# Altium project Nhúng - Nhóm 2.PrjPcb
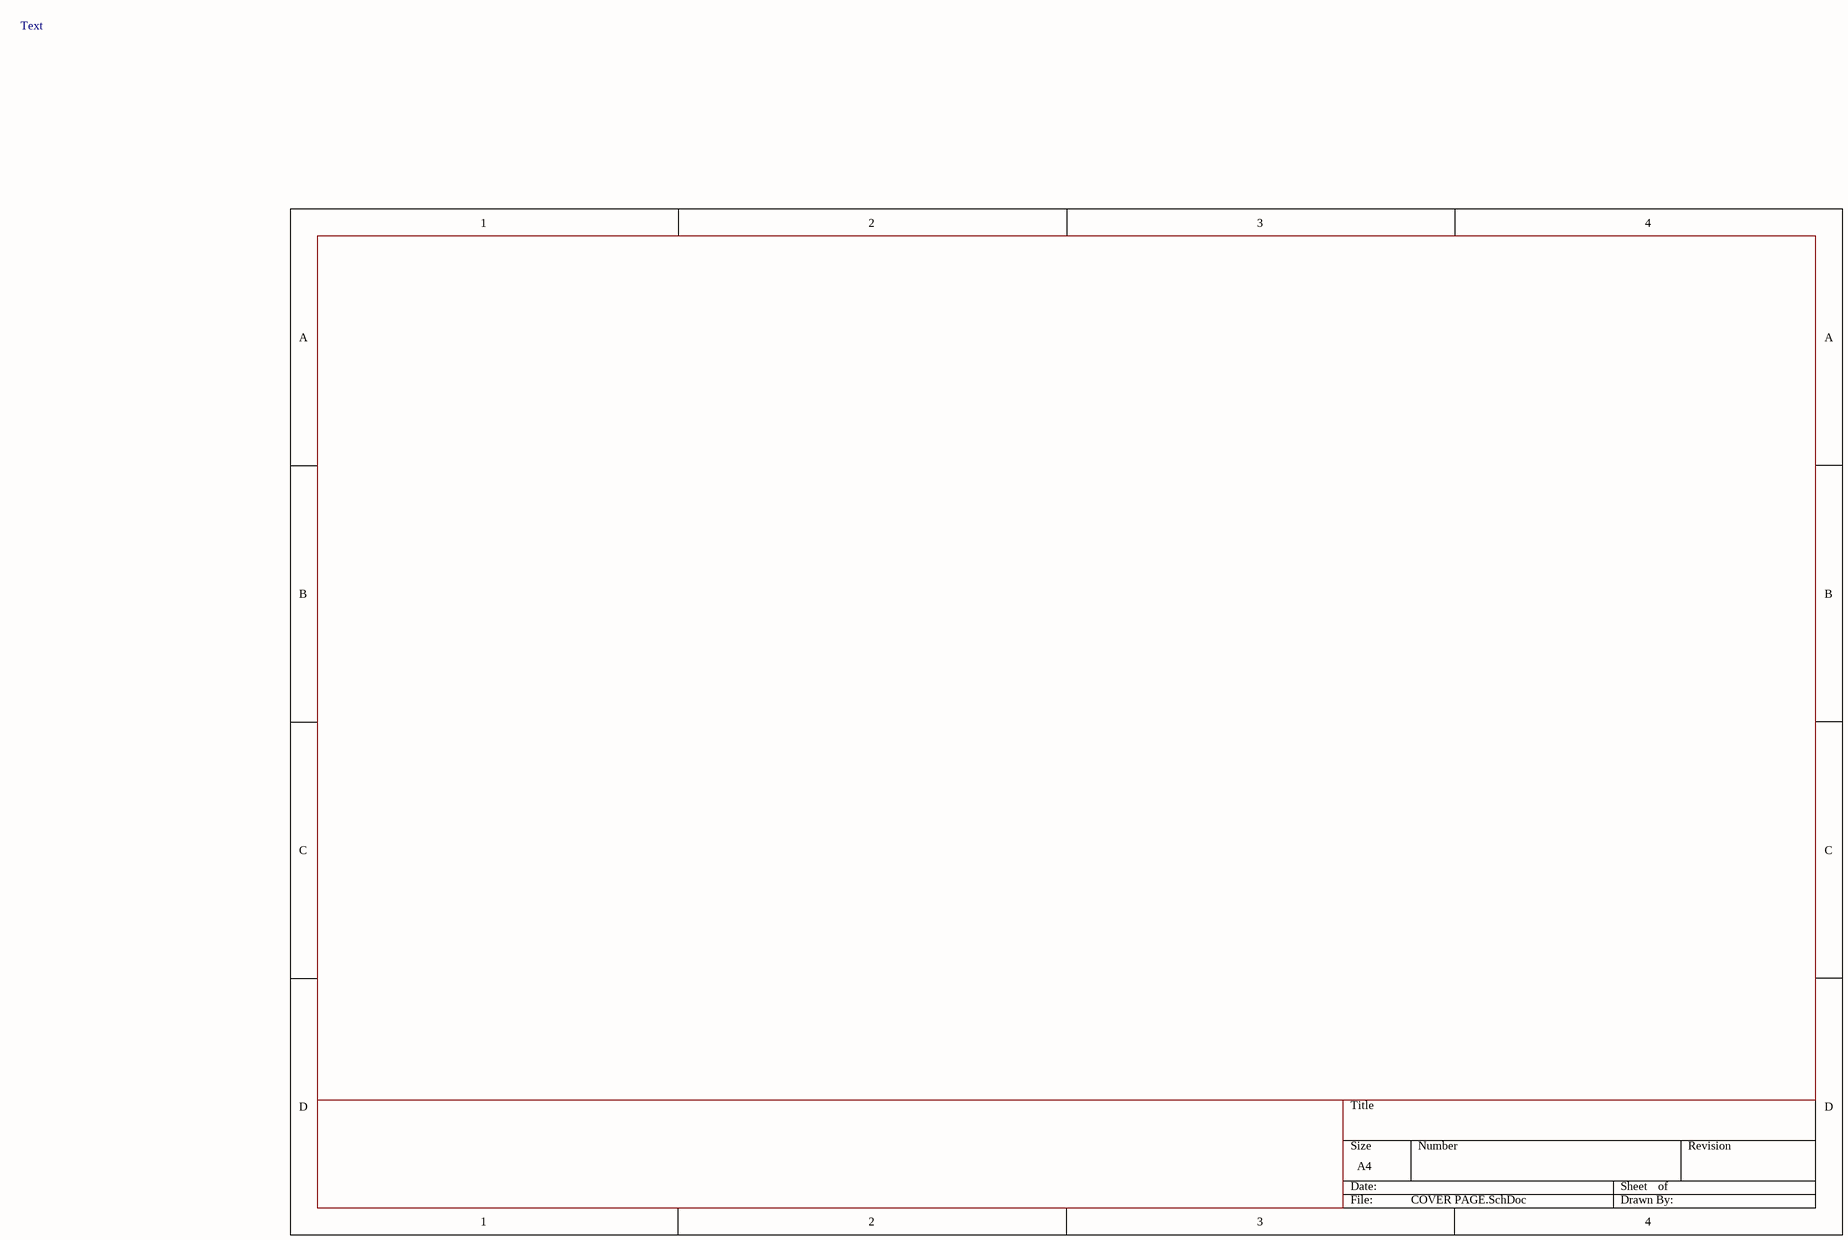
[diagram p0: COVER PAGE.SchDoc]
5 sheets, 82 parts. Net scope: flat (ports and power ports of the same name join across sheets).
Board file: LAYOUT MODULE WIFI LAMP CONTROL.PcbDoc
Sheets:
  COVER PAGE.SchDoc
  BLOCK DIAGRAM.SchDoc
  NODE MCU ESP12.SchDoc
  MODULE WIFI LAMP CONTROL.SchDoc
  MODULE PINOUT WIFI LAMP CONTROL.SchDoc

## Sheet COVER PAGE.SchDoc
size A4

### Notes on the sheet
- Text

## Sheet BLOCK DIAGRAM.SchDoc
size A4
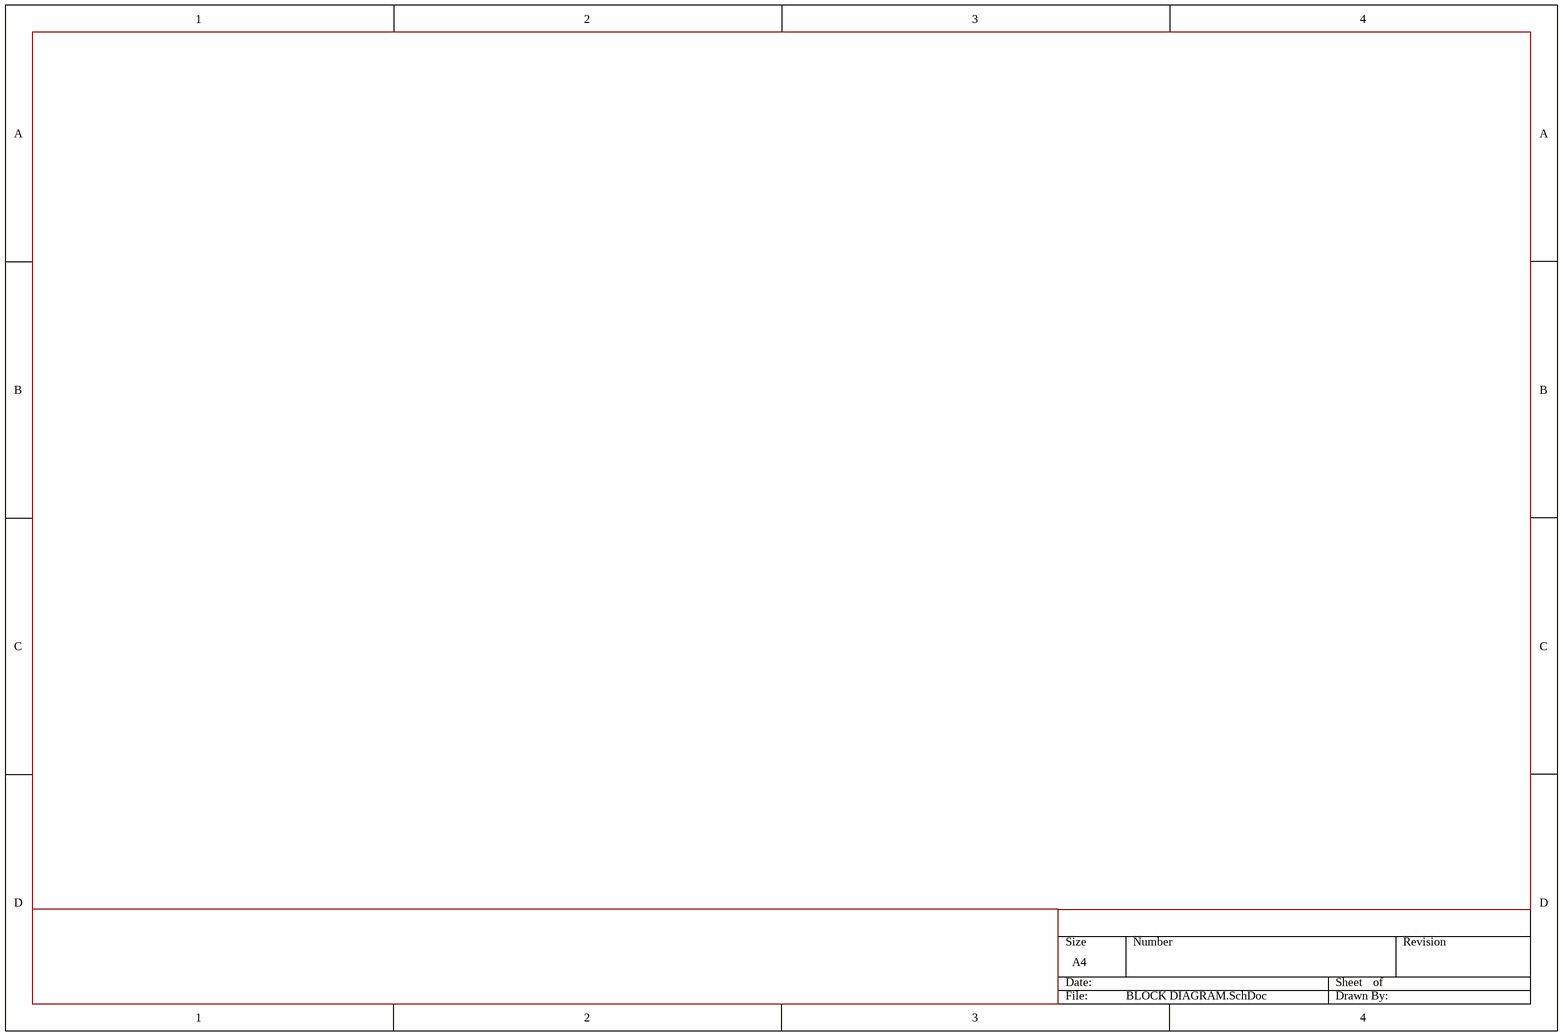
[diagram p1: BLOCK DIAGRAM.SchDoc]

## Sheet NODE MCU ESP12.SchDoc
size A4
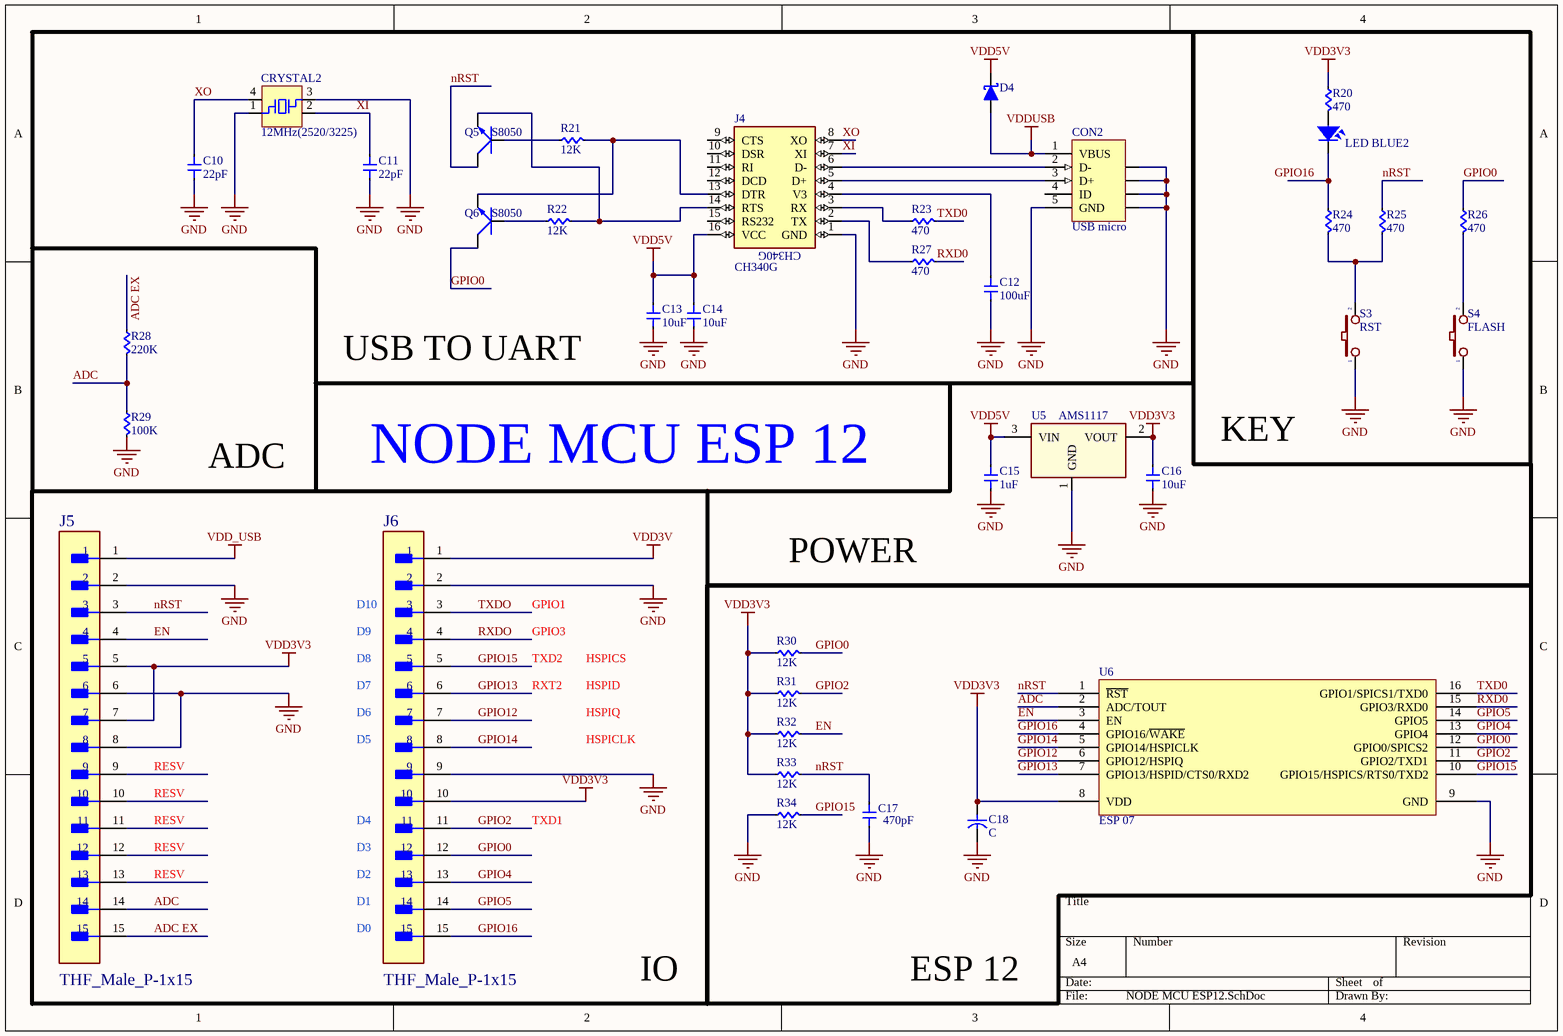
[diagram p2: NODE MCU ESP12.SchDoc]

### Parts
C10  22pF  [Cap 0201]
C11  22pF  [Cap 0201]
C12  100uF  [Cap 0201]
C13  10uF  [Cap 0201]
C14  10uF  [Cap 0201]
C15  1uF  [Cap 0201]
C16  10uF  [Cap 0201]
C17  470pF  [Cap 1210]
C18  C  [C SMD TAN 1210 (B)]
CON2  USB micro  [CONN/USB/MICRO/RA]
CRYSTAL2  12MHz(2520/3225)  [Crystal SMD 4PIN 32x25]
D4  (no value)  [DO-214AC (SMA)]
J4  CH340G  [SOIC-16]
J5  THF_Male_P-1x15  [FP-90121-0135-MFG]
J6  THF_Male_P-1x15  [FP-90121-0135-MFG]
LED_BLUE2  LED  [LED-5-BLUE]  (value not drawn)
Q5  S8050  [TO92]
Q6  S8050  [TO92]
R20  470  [RES 0402]
R21  12K  [RES 0402]
R22  12K  [RES 0402]
R23  470  [RES 0402]
R24  470  [RES 0402]
R25  470  [RES 0402]
R26  470  [RES 0402]
R27  470  [RES 0402]
R28  220K  [RES 0402]
R29  100K  [RES 0402]
R30  12K  [RES 0402]
R31  12K  [RES 0402]
R32  12K  [RES 0402]
R33  12K  [RES 0402]
R34  12K  [RES 0402]
S3  RST  [SW1-SMD]
S4  FLASH  [SW1-SMD]
U5  AMS1117  [SOT-223]
U6  ESP 07  [ESP8266 07]

### Blocks framed on the sheet
KEY: LED_BLUE2 R20 R24-R26 S3 S4
NODE MCU ESP 12: J5 J6

### Nets
GND: C10.1 C11.1 C12.1 C13.1 C14.1 C15.1 C16.1 C17.1 C18.2 CON2.5(GND) CON2.6(SHLD) CON2.7(SHLD) CON2.8(SHLD) CON2.9(SHLD) CRYSTAL2.1(XTAL) CRYSTAL2.3(XTAL) J4.1(GND) J5.2 J5.6 J5.8 J6.2 J6.9 R29.2 R34.1 S3.1 S4.1 U5.1(GND) U6.9(GND)
VDD3V: J6.1
VDD3V3: C16.2 C18.1 J5.5 J5.7 J6.10 R20.1 R30.1 R31.1 R32.1 R33.1 U5.2(VOUT) U6.8(VDD)
VDD5V: C13.2 C14.2 C15.2 D4.2(K) J4.16(VCC) U5.3(VIN)
VDD_USB: J5.1
VDDUSB: CON2.1(VBUS) D4.1(A)
ADC: J5.14 R28.2 R29.1 U6.2(ADC/TOUT)
ADC EX: J5.15 R28.1
EN: J5.4 R32.2 U6.3(EN)
GPIO0: J6.12 Q6.3(C) R26.1 R30.2 U6.12(GPIO0/SPICS2)
GPIO1: J6.3  [also labelled TXDO]
GPIO2: J6.11 R31.2 U6.11(GPIO2/TXD1)  [also labelled TXD1]
GPIO3: J6.4  [also labelled RXDO]
GPIO4: J6.13 U6.13(GPIO4)
GPIO5: J6.14 U6.14(GPIO5)
GPIO12: J6.7 U6.6(GPIO12/HSPIQ)
GPIO13: J6.6 U6.7(GPIO13/HSPID/CTS0/RXD2)  [also labelled RXT2]
GPIO14: J6.8 U6.5(GPIO14/HSPICLK)
GPIO15: J6.5 R34.2 U6.10(GPIO15/HSPICS/RTS0/TXD2)  [also labelled TXD2]
GPIO16: J6.15 U6.4(GPIO16/~{WAKE})
nRST: C17.2 J5.3 Q5.3(C) R25.1 R33.2 U6.1(~{RST})
RESV: J5.9 J5.10 J5.11 J5.12 J5.13
RXD0: R27.2 U6.15(GPIO3/RXD0)
TXD0: R23.2 U6.16(GPIO1/SPICS1/TXD0)
XI: C11.2 CRYSTAL2.2(GND) J4.7(XI)
XO: C10.2 CRYSTAL2.4(GND) J4.8(XO)
NetC12_2: C12.2 J4.4(V3)
NetCON2_2: CON2.2(D-) J4.6(D-)
NetCON2_3: CON2.3(D+) J4.5(D+)
NetJ4_2: J4.2(TX) R27.1
NetJ4_3: J4.3(RX) R23.1
NetJ4_13: J4.13(DTR) Q6.1(E) R21.2
NetJ4_14: J4.14(RTS) Q5.1(E) R22.2
NetLED_BLUE2_1: LED_BLUE2.1 R20.2
NetLED_BLUE2_2: LED_BLUE2.2 R24.1
NetQ5_2: Q5.2(B) R21.1
NetQ6_2: Q6.2(B) R22.1
NetR24_2: R24.2 R25.2 S3.2
NetR26_2: R26.2 S4.2

Not connected (* = marked no-connect by the designer): CON2 4(ID); J4 9(CTS) 10(DSR) 11(RI) 12(DCD) 15(RS232)

### Notes on the sheet
- USB TO UART
- ADC
- POWER
- IO
- ESP 12
- Labels drawn without touching a wire or pin: D0, D1, D2, D3, D4, D5, D6, D7, D8, D9, D10, GPIO16, HSPICLK, HSPICS, HSPID, HSPIQ

### Library data of the parts
C10-C16 = Cap 0201: Capacitor SMD 0201
C17 = Cap 1210: Capacitor SMD 1210
C18 = Capacitor: Capacitor pol
CON2 = CON USB micro: USB micro, 5 pins
CRYSTAL2 = Crystal 4pin
D4 = Diode Schottky: Schottky Diode
J4 = CH340G: USB Interface Integrated Circuit; MF: WCH; MP: Ch340G; Price: None; SnapEDA_Link: https://www.snapeda.com/parts/Ch340G/WCH/view-part/6287223/?ref=snap; Package: Package; Check_prices: https://www.snapeda.com/parts/Ch340G/WCH/view-part/6287223/?ref=eda; Value: *; Availability: No availability data
J5 J6 = CMP-04776-000526-1: CONN HEADER R/A 15POS 2.54MM; Number of Contacts: 15; Voltage Rating: 350V; Glow Wire Compliant: Non-compliant; Current Rating: 3A; Gender: Male; Number of Circuits: 15; Max Operating Temperature: 125°C; Packaging: Tray; Contact Plating: Tin; Package Quantity: 1800; Housing Material: Polyester; Number of Positions: 15; Number of Rows: 1; Pitch: 2.54mm; Series: 90121; Mount: Through Hole; Radiation Hardening: No; Contact Material: Brass; Min Operating Temperature: -55°C; Termination: Through Hole; RoHS Compliant: Yes; Orientation: Right Angle
LED_BLUE2 = LED: LED Single colour Green and Red; Value: LED 3 ly Single Colour
Q5 Q6 = Trans 2N3904: NPN transistor EBC; Value: C9014
R20-R34 = RES 0402: RES SMD 0402; Manufacturer: Vishay Dale; Manufacturer Part Number: CRCW040210K0FKED; Resistance (Ohms): 10k; Tolerance: ±1%; Power (Watts): 0.063W, 1/16W; Temperature Coefficient: ±100ppm/°C; Supplier 1: Digi-Key; RoHS: RoHS Compliant; Category: Resistors; Stock 1: 2392462; Pricing 1: 10=0.083, 50=0.0444, 200=0.0255, 1000=0.0174 (USD); Packaging: Cut Tape (CT); Composition: Thick Film; Features: Automotive AEC-Q200; Operating Temperature: -55°C ~ 155°C; Package / Case: 0402 (1005 Metric); Supplier Device Package: 0402 (1005 Metric); Size / Dimension: 0.039" L x 0.020" W (1.00mm x 0.50mm); Height: 0.016" (0.40mm); Number of Terminations: 2; ComponentLink1URL: http://www.vishay.com/docs/20035/dcrcwe3.pdf; ComponentLink1Description: http://www.vishay.com/docs/20035/dcrcwe3.pdf; Supplier Part Number 1: 541-10.0KLCT-ND
S3 S4 = SW2: Switch button 2 pin; Value: SW chip 2 pin
U5 = AMS1117: 1A LDO Voltage Regulator, ADJ or fixed 1.5/1.8/2.5/2.85/3.3/5V
U6 = ESP8266 07: ESP8266 07 16 Pin; IC: ESP8266-EX; Vendor: Ai-thinker

## Sheet MODULE WIFI LAMP CONTROL.SchDoc
size A4
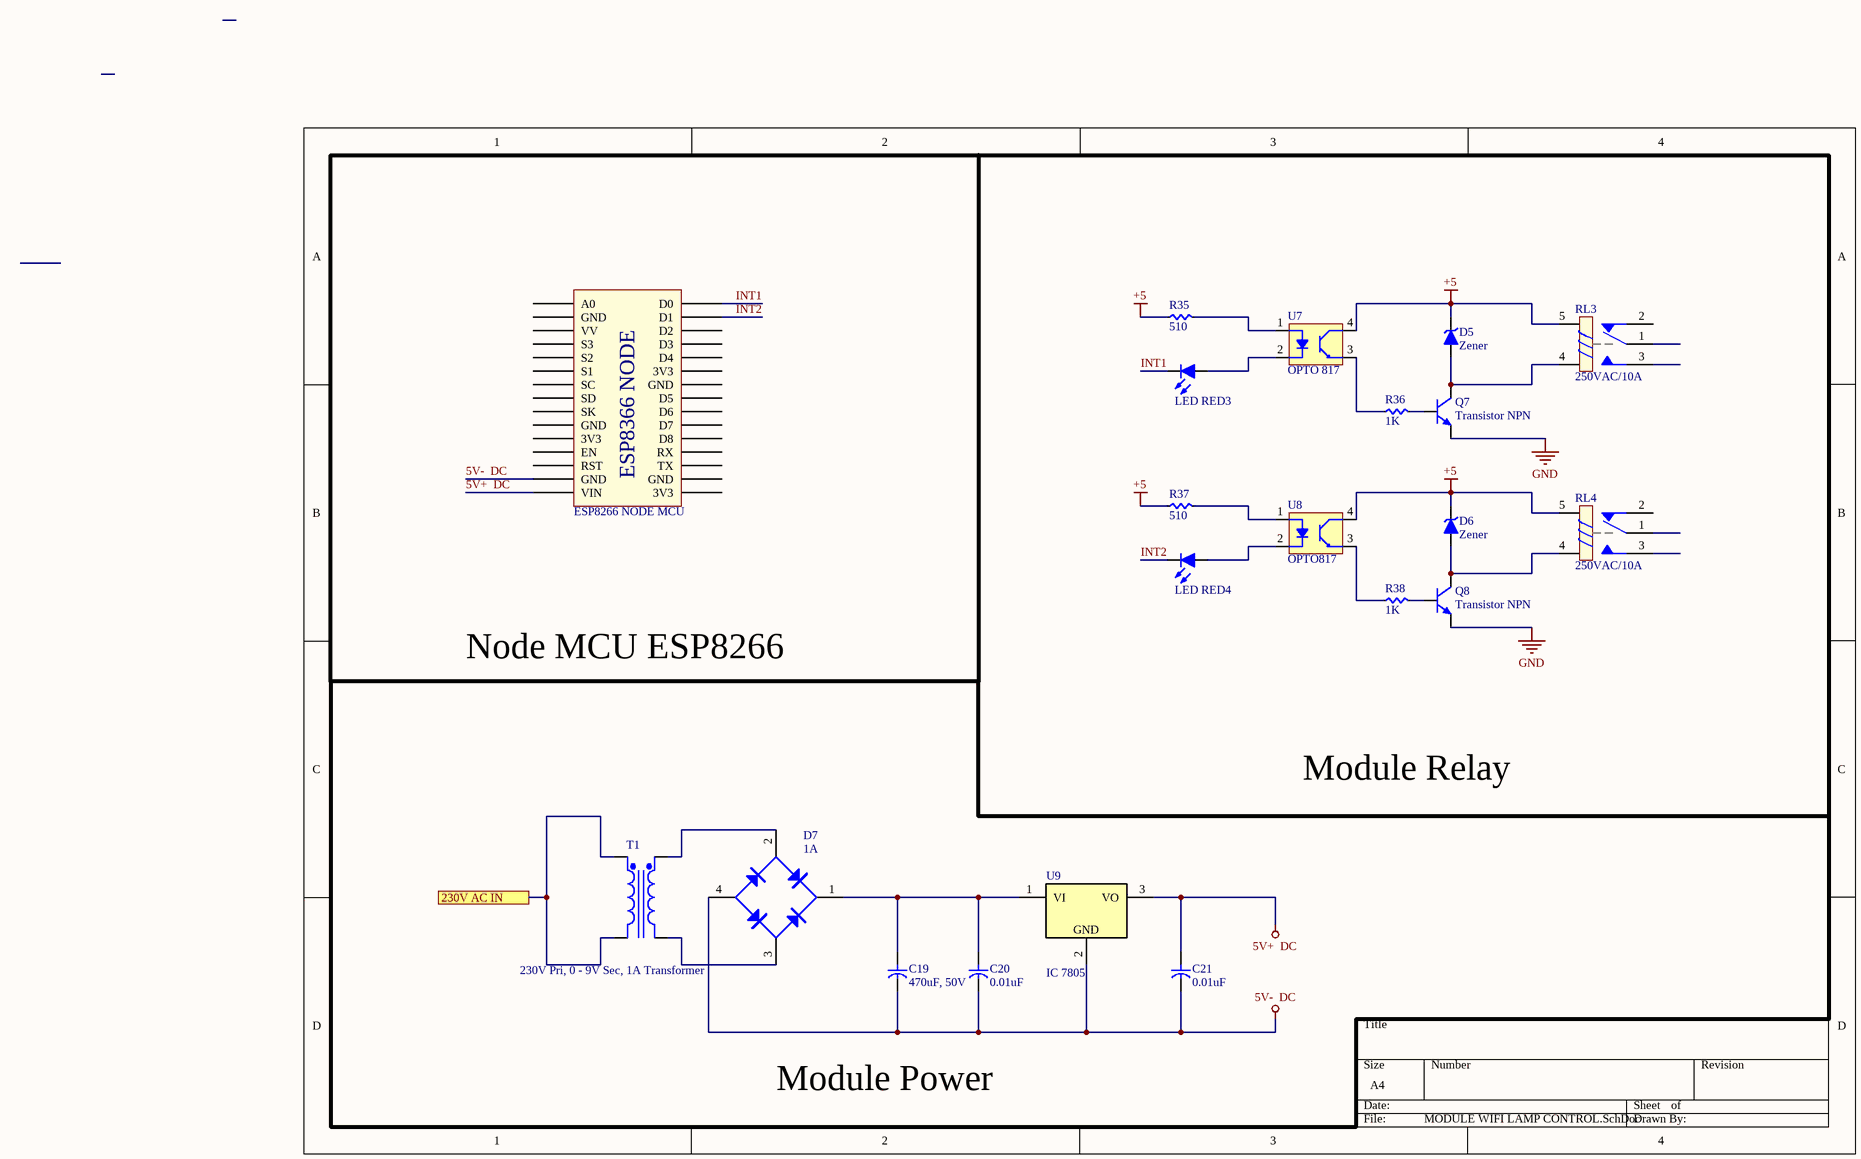
[diagram p3: MODULE WIFI LAMP CONTROL.SchDoc]

### Parts
?  ESP8266 NODE MCU  [ESP8266 NODE MCU]
C19  470uF, 50V  [CYL/D.500/LS.200]
C20  0.01uF  [CYL/D.500/LS.200]
C21  0.01uF  [CYL/D.500/LS.200]
D5  Zener  [DO-41]
D6  Zener  [DO-41]
D7  1A  [BRIDGE_DAN]
LED_RED3  LED RED  [LED 5MM - RED]  (value not drawn)
LED_RED4  LED RED  [LED 5MM - RED]  (value not drawn)
Q7  Transistor NPN  [SOT-23]
Q8  Transistor NPN  [SOT-23]
R35  510  [RES 0402]
R36  1K  [RES 0402]
R37  510  [RES 0402]
R38  1K  [RES 0402]
RL3  250VAC/10A  [Relay 5 Chan SRD]
RL4  250VAC/10A  [Relay 5 Chan SRD]
T1  230V Pri, 0 - 9V Sec, 1A Transformer  [TRF_4]
U7  OPTO 817  [DIP4 - PC817]
U8  OPTO817  [DIP4 - PC817]
U9  IC 7805  [DPAK_118_446_112X59_SMD]

### Ports
230V AC IN

### Nets
5V+  DC: ?.15(VIN) C21.1 U9.3(VO)
5V-  DC: ?.14(GND) C19.2 C20.2 C21.2 D7.4(V-) U9.2
+5: D5.2(K) D6.2(K) R35.1 R37.1 RL3.5 RL4.5 U7.4(C) U8.4(C)
GND: Q7.2(E) Q8.2(E)
INT1: ?.30(D0) LED_RED3.2(K)
INT2: ?.29(D1) LED_RED4.2(K)
NetC19_1: C19.1 C20.1 D7.1(V+) U9.1(VI)
NetD5_1: D5.1(A) Q7.3(C) RL3.4
NetD6_1: D6.1(A) Q8.3(C) RL4.4
NetD7_2: D7.2(AC) T1.3(Sec+)
NetD7_3: D7.3(AC) T1.4(Sec-)
NetLED_RED3_1: LED_RED3.1(A) U7.2(K)
NetLED_RED4_1: LED_RED4.1(A) U8.2(K)
NetQ7_1: Q7.1(B) R36.2
NetQ8_1: Q8.1(B) R38.2
NetR35_2: R35.2 U7.1(A)
NetR36_1: R36.1 U7.3(E)
NetR37_2: R37.2 U8.1(A)
NetR38_1: R38.1 U8.3(E)
NetT1_1: T1.1(Pri+) T1.2(Pri-) ; port 230V AC IN

Not connected (* = marked no-connect by the designer): ? 1(A0) 2(GND) 3(VV) 4(S3) 5(S2) 6(S1) 7(SC) 8(SD) 9(SK) 10(GND) 11(3V3) 12(EN) 13(RST) 16(3V3) 17(GND) 18(TX) 19(RX) 20(D8) 21(D7) 22(D6) 23(D5) 24(GND) 25(3V3) 26(D4) 27(D3) 28(D2); RL3 1 2 3; RL4 1 2 3

### Notes on the sheet
- Node MCU ESP8266
- Module Relay
- Module Power
- (in symbol ESP8266 NODE MCU) ESP8366 NODE
- (in symbol REG_35V_5V-1.5A-7.5W-DPAK) GND

### Library data of the parts
C19-C21 = Capacitor: Capacitor pol
D5 D6 = Diode Zener: Zener Diode
D7 = BRIDGE1: Diode Bridge
LED_RED3 LED_RED4 = Led: Typical LED
Q7 Q8 = Transistor NPN: NPN Bipolar Transistor
R35-R38 = RES 0402: as R20 on sheet NODE MCU ESP12; Supplier 1: Digi-Key; RoHS: RoHS Compliant; Category: Resistors; Stock 1: 2392462; Pricing 1: 10=0.083, 50=0.0444, 200=0.0255, 1000=0.0174 (USD); Packaging: Cut Tape (CT); Composition: Thick Film; Features: Automotive AEC-Q200; Operating Temperature: -55°C ~ 155°C; Package / Case: 0402 (1005 Metric); Supplier Device Package: 0402 (1005 Metric); Size / Dimension: 0.039" L x 0.020" W (1.00mm x 0.50mm); Height: 0.016" (0.40mm); Number of Terminations: 2; ComponentLink1URL: http://www.vishay.com/docs/20035/dcrcwe3.pdf; ComponentLink1Description: http://www.vishay.com/docs/20035/dcrcwe3.pdf; Supplier Part Number 1: 541-10.0KLCT-ND
RL3 RL4 = Relay 5 Chan SRD: Relay 5 Chan; Ma_Hang: MH009374; Ten: Relay 5V10A SRD-05VDC-SL-C Chính Hãng
T1 = Trans Cupl: Transformer (Coupled Inductor Model); Published: 8-Jun-2000; LatestRevisionDate: 17-Jul-2002; LatestRevisionNote: Re-released for DXP Platform.; PackageReference: TRF_4; Publisher: Altium Limited; PackageDescription: Transformer; 4 Leads
U7 U8 = PC817: Opto PC817B
U9 = REG_35V_5V-1.5A-7.5W-DPAK: Linear Voltage Regulator IC 1 Output 1.5A DPAK; Manufacturer: Diodes; Manufacturer Part Number: L7805CDT-TR; Alternate Part Number-1: CJ7805 3%; Case/Package: DPAK; Supplier-1: SP ROAD; Supplier Part Number-1: L7805CDT-TR

## Sheet MODULE PINOUT WIFI LAMP CONTROL.SchDoc
size A4
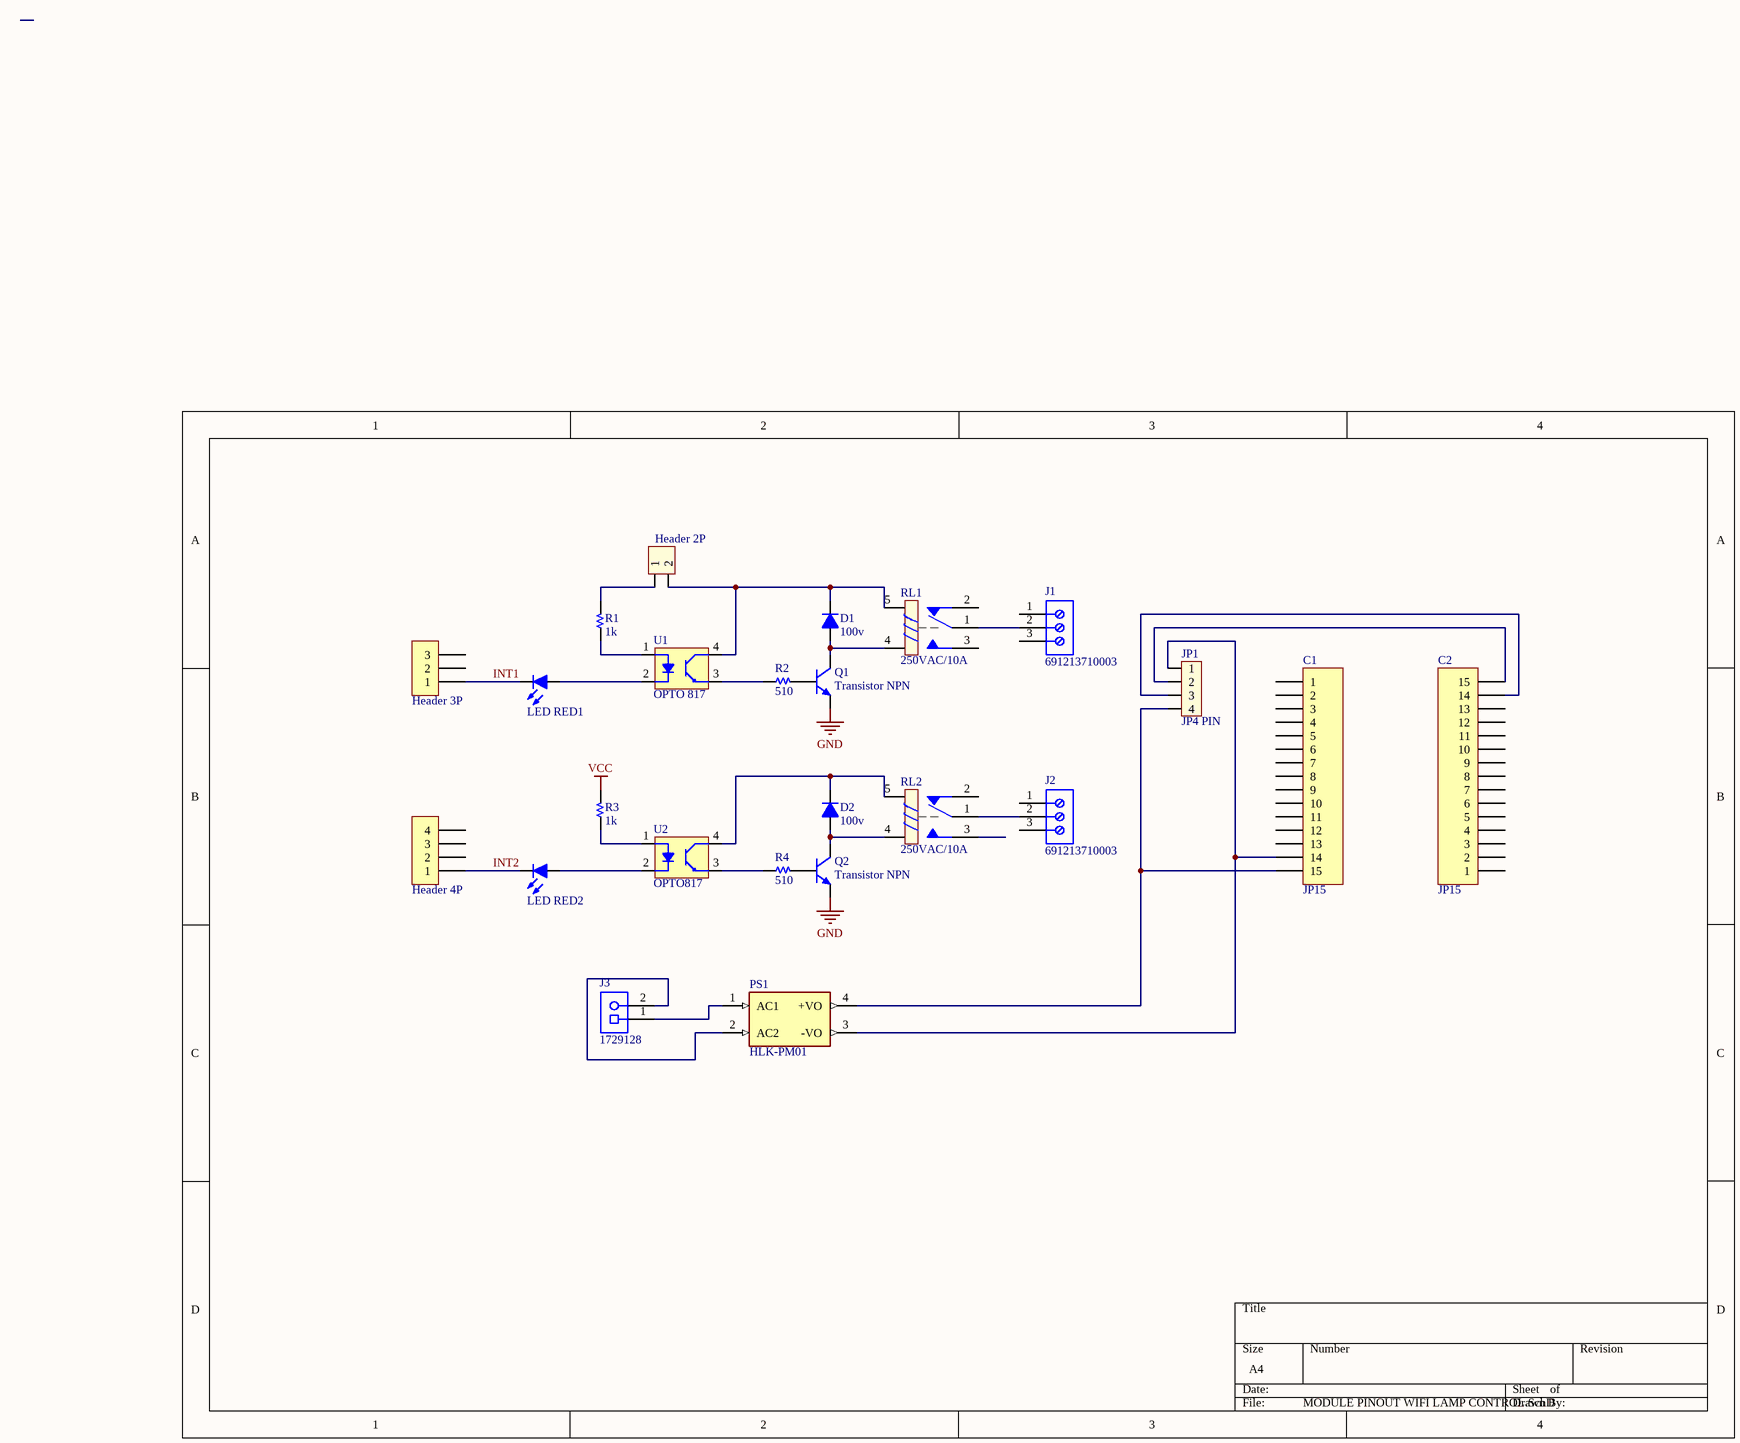
[diagram p4: MODULE PINOUT WIFI LAMP CONTROL.SchDoc]

### Parts
C1  JP15  [JP15-C1T]
C2  JP15  [JP15-C1T]
D1  100v  [DIODE 0.5A]
D2  100v  [DIODE 0.5A]
H1  Header 2P  [XH2.54M-2]
H2  Header 3P  [XH2.54M-3]
H3  Header 4P  [XH2.54M-4]
J1  691213710003  [691213710003]
J2  691213710003  [691213710003]
J3  1729128  [PHOE-1729128-2_V]
JP1  JP4 PIN  [JP4]
LED_RED1  LED RED  [LED 5MM - RED]  (value not drawn)
LED_RED2  LED RED  [LED 5MM - RED]  (value not drawn)
PS1  HLK-PM01  [CONV_HLK-PM01]
Q1  Transistor NPN  [SOT-23]
Q2  Transistor NPN  [SOT-23]
R1  1k  [R 1/4W/300]
R2  510  [R 1/4W/300]
R3  1k  [R 1/4W/300]
R4  510  [R 1/4W/300]
RL1  250VAC/10A  [Relay 5 Chan SRD]
RL2  250VAC/10A  [Relay 5 Chan SRD]
U1  OPTO 817  [DIP4 - PC817]
U2  OPTO817  [DIP4 - PC817]

### Nets
GND: Q1.2(E) Q2.2(E)
VCC: R3.2
INT1: H2.1 LED_RED1.2(K)
INT2: H3.1 LED_RED2.2(K)
NetC1_14: C1.14 JP1.1 PS1.3(-VO)
NetC1_15: C1.15 JP1.4 PS1.4(+VO)
NetC2_14: C2.14 JP1.3
NetC2_15: C2.15 JP1.2
NetD1_1: D1.1(A) Q1.3(C) RL1.4
NetD1_2: D1.2(K) H1.2 RL1.5 U1.4(C)
NetD2_1: D2.1(A) Q2.3(C) RL2.4
NetD2_2: D2.2(K) RL2.5 U2.4(C)
NetH1_1: H1.1 R1.2
NetJ1_2: J1.2 RL1.1
NetJ2_2: J2.2 RL2.1
NetJ3_1: J3.1 PS1.1(AC1)
NetJ3_2: J3.2 PS1.2(AC2)
NetLED_RED1_1: LED_RED1.1(A) U1.2(K)
NetLED_RED2_1: LED_RED2.1(A) U2.2(K)
NetQ1_1: Q1.1(B) R2.2
NetQ2_1: Q2.1(B) R4.2
NetR1_1: R1.1 U1.1(A)
NetR2_1: R2.1 U1.3(E)
NetR3_1: R3.1 U2.1(A)
NetR4_1: R4.1 U2.3(E)

Not connected (* = marked no-connect by the designer): C1 1 2 3 4 5 6 7 8 9 10 11 12 13; C2 1 2 3 4 5 6 7 8 9 10 11 12 13; H2 2 3; H3 2 3 4; J1 1 3; J2 1 3; RL1 2 3; RL2 2 3

### Library data of the parts
C1 C2 = JP15: WR-PHD 2.54 mm Angled Socket Header; Manufacturer: W¨¹rth Elektronik eiSos GmbH; partNo: 613015143121; ComponentLink1 Description: Manufacturer; ComponentLink2 Description: Datasheet; NoPins: 15; Created Date: 29 March 2013; ComponentLink1URL: http://www.we-online.com; ComponentLink2URL: http://katalog.we-online.de/em/datasheet/6130xx143121.pdf; Created by: Karrer Zheng
D1 D2 = Diode 1N4148: Cắm; Ten_Linh_Kien: Diode 1N4148 DO35 450mA 100V ( 1N4148 DIP); Don_Vi: Con; Ma_Hang: MH001065; Ghi Chu: *; Kieu_Chan: *; Chung_Loai: Cắm
H1 = Header 2P 2.54 Duc Thang: Cắm; Ten_Linh_Kien: Header 2P XH2.54-2P Đực Thẳng; Don_Vi: Con; Ma_Hang: MH001283; Chung_Loai: Cắm
H2 = Header 3P 2.54 Duc Thang: Cắm; Ten_Linh_Kien: Header 3P XH2.54-3P Đực Thẳng; Don_Vi: Con; Ma_Hang: MH001292; Chung_Loai: Cắm
H3 = Header 4P 2.54 Duc Thang: Cắm; Ten_Linh_Kien: Header 4P XH2.54-4P Đực Thẳng; Don_Vi: Con; Ma_Hang: MH001285; Chung_Loai: Cắm
J1 J2 = CMP-1502-02527-2: NexarPartId: 8917719; Number of Contacts: 3; Wire/Cable Gauge: 16AWG; Wire Gauge (Max): 26AWG; Connector Type: PCB, Terminal Block; Number of Levels: 1; Plating: Brass, Steel; Current: 10A; Voltage: 300V; Stripping Length: -7mm; Pitch: 5.0038mm; REACH SVHC: Unknown; Mount: Through Hole; Max Operating Temperature: 105°C; Contact Plating: Tin; Termination: Screw; Contact Material: Brass; Housing Material: Nylon; Color: Green; RoHS: Compliant; Wire Gauge (Min): 16AWG; Min Operating Temperature: -40°C; Length: 8.3mm; Packaging: Box; Number of Pins: 3; Lead Pitch: 5mm; Number of Positions Per Level: 3; Height: 10mm; Width: 15.6mm
J3 = CMP-2000-05815-1: PCB Terminal Block, 13.5 A, 400 V, 2-Pin THD, RoHS, Bulk; Manufacturer: Phoenix Contact; Package Version: 03/2015; No. of Rows: 1; Pitch: 5.08mm; No. of Positions: 2; Voltage Rating: 400V; Current Rating: 13500mA; Manufacturer URL: http://www.phoenixcontact.com/; Datasheet URL: https://datasheet.ciiva.com/16046/1729128-16046181.pdf; RoHS: TRUE; Package URL: https://www.phoenixcontact.com/online/portal/pi/pxc/product_detail_page/!ut/p/b1/3VdJjqNKFDxLH8AFycySyWY2ozFsEPOMMQaDOX1XedGL_1Vdm5YXJleknhSKeBkvI6EA8ncAo3AYoDhBQGco6KN7VURTdemj9us_IEKEZo_YHiPAEWEFmDGOHMORkqKYCORBZxgL7ZoaZYcbFFUZ3fqxSY6GOuxydWUuHqz1ynmMFygu583Bob0Ewr6Sd_l-5m-kAueHiB0jpRwZwe58wwtkpxtMYd_LmGcDRU02dRNEyWt6Y2ti5pSyJ_reIkzIulrqApdnbT11V5jnCKbYNCvhEM1MCpPByat_X379-iThf08CI5GfOPqfBeS3BRoBOdD55AKVv0iLwCMq-2BrzXWSGRH7pUGD9uwXQjiph3xL0DKQwdGa0JImiIOmBNOestqgwTHSSs2oOep-78apyXQBvNi8ZLaFjvjWvcaUEBu0MC6Wbe-d6mB0FAebo2lUWinqYaZs5DAYzV0RP9yitUjnGJ0iI9xhZkT42OCQNUJJhkgWINNQLP2JFP6OpMg3JCVg70jqHT0lvKOnhHf0lPuOnnLf0VPuWx6_dxwUIvwk5WMkT0kLL1mh61l2yZVSzG3pYV_bqo-mj6uMKwKwdnnW8Jh5RTOJzMOA5c-eJDaZQw4mTMPH02PvS_ZAqNVjVTo2WyYLkwH_KU1mmmG5kjRhDqPXLwwVHvVOjCM60-fpXvTDfMGW1PVFVS1r4e4yVDk4ZdNbkUHvqPqQSeian4UD39fNKmachqdJ1NJbyk8rXT9mXTvPk3oE5meulKGgiruPJek-4I9hTT6G8ZLOyRSm2RRVbThERQad5OS28hdt4YW4vG0stgYYzsWsK4_7y6DZMjJSCqri1kyiZR5vD7pwIrNR7QwPHTcLTI5qT7eRlpHrdGiupYlqQDJ7zy_CND8fWWBoLRXxk1RVcXiBQwbTD4Xi7KL-FuO94t9xaqweXzH; PartNumber: 1729128; Package Description: 2-Pin Through Hole Device, Body 8.1 x 10.16 mm, Pitch 5.08 mm; Datasheet Version: 12/2013; Mounting Technology: ThroughHole; Orientation: Horizontal; Package Reference: 1729128-2; Packing: Bulk
JP1 = JP4: Value: JP4
LED_RED1 LED_RED2 = Led: Typical LED
PS1 = HLK-PM01: The HLK-PM01 is a small size low cost AC to DC converter which can take in 110V/220V AC at 50/60 Hz and give 5V 3W output. The module is can be used in designs which run on 5V and needs to be powered form the AC mains.; MF: Hi-link; SnapEDA_Link: https://www.snapeda.com/parts/hlk-pm01/Hi-link/view-part/?ref=snap; Package: None; Value: *; MP: hlk-pm01; Check_prices: https://www.snapeda.com/parts/hlk-pm01/Hi-link/view-part/?ref=eda
Q1 Q2 = Transistor NPN: NPN Bipolar Transistor
R1-R4 = Resistor
RL1 RL2 = Relay 5 Chan SRD: as RL3 on sheet MODULE WIFI LAMP CONTROL
U1 U2 = PC817: Opto PC817B

## Nets that join several sheets
GND: NODE MCU ESP12 (28 pins), MODULE WIFI LAMP CONTROL (Q7.2 Q8.2), MODULE PINOUT WIFI LAMP CONTROL (Q1.2 Q2.2)